# Altium project Testbench - Main.PrjPcb
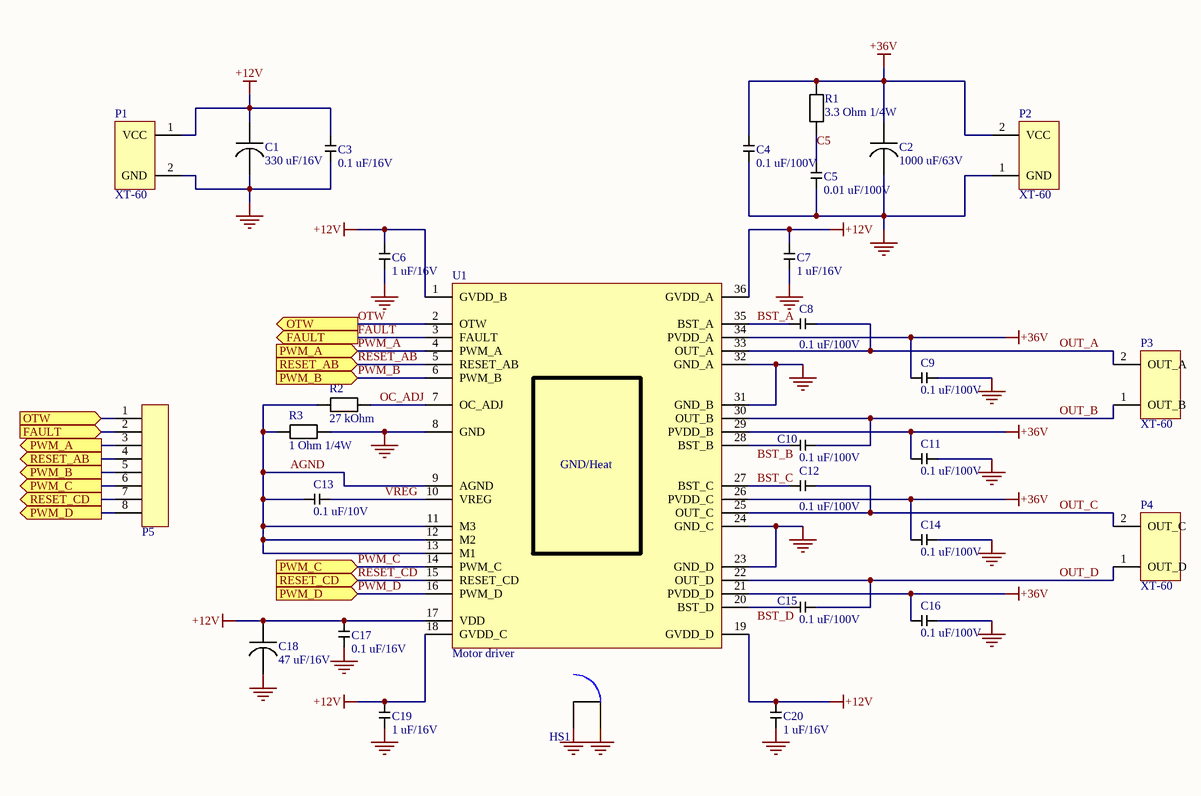
[diagram p0: TB Motor driver pcb.SchDoc]
1 sheet, 30 parts. Net scope: flat (ports and power ports of the same name join across sheets).
Board file: TB Motor driver pcb.PcbDoc

## Sheet TB Motor driver pcb.SchDoc
size A4

### Parts
C1  value 330 uF/16V  [C_EL_SMT_Ø10]  (hidden comment: C_EL_SMT_Ø10)
C2  value 1000 uF/63V  [C_EL_SMT_Ø18]  (hidden comment: C_EL_SMT_Ø18)
C3  value 0.1 uF/16V  [C_SMD_0805_pcb]  (hidden comment: SMD)
C4  value 0.1 uF/100V  [C_SMD_0805_pcb]  (hidden comment: SMD)
C5  value 0.01 uF/100V  [C_SMD_0805_pcb]  (hidden comment: SMD)
C6  value 1 uF/16V  [C_SMD_0805_pcb]  (hidden comment: SMD)
C7  value 1 uF/16V  [C_SMD_0805_pcb]  (hidden comment: SMD)
C8  value 0.1 uF/100V  [C_SMD_0805_pcb]  (hidden comment: SMD)
C9  value 0.1 uF/100V  [C_SMD_0805_pcb]  (hidden comment: SMD)
C10  value 0.1 uF/100V  [C_SMD_0805_pcb]  (hidden comment: SMD)
C11  value 0.1 uF/100V  [C_SMD_0805_pcb]  (hidden comment: SMD)
C12  value 0.1 uF/100V  [C_SMD_0805_pcb]  (hidden comment: SMD)
C13  value 0.1 uF/10V  [C_SMD_0805_pcb]  (hidden comment: SMD)
C14  value 0.1 uF/100V  [C_SMD_0805_pcb]  (hidden comment: SMD)
C15  value 0.1 uF/100V  [C_SMD_0805_pcb]  (hidden comment: SMD)
C16  value 0.1 uF/100V  [C_SMD_0805_pcb]  (hidden comment: SMD)
C17  value 0.1 uF/16V  [C_SMD_0805_pcb]  (hidden comment: SMD)
C18  value 47 uF/16V  [C_EL_SMT_Ø6.3]  (hidden comment: C_EL_SMT_Ø6.3)
C19  value 1 uF/16V  [C_SMD_0805_pcb]  (hidden comment: SMD)
C20  value 1 uF/16V  [C_SMD_0805_pcb]  (hidden comment: SMD)
HS1  ATS-1042-C1-R0  [HS_TB]  (value not drawn)
P1  XT-60  [XT-60]
P2  XT-60  [XT-60]
P3  XT-60  [XT-60]
P4  XT-60  [XT-60]
P5  JST_SE_8PIN  [JST_SE_8PIN]  (value not drawn)
R1  value 3.3 Ohm 1/4W  [R_SMD_0805_pcb]  (hidden comment: SMD)
R2  value 27 kOhm  [R_SMD_0805_pcb]  (hidden comment: SMD)
R3  value 1 Ohm 1/4W  [R_SMD_0805_pcb]  (hidden comment: SMD)
U1  Motor driver  [DRV8432DKDR-SOP36]

### Ports
FAULT (in), FAULT (out), OTW (in), OTW (out), PWM_A (in), PWM_A (out), PWM_B (in), PWM_B (out), PWM_C (in), PWM_C (out), PWM_D (in), PWM_D (out), RESET_AB (in), RESET_AB (out), RESET_CD (in), RESET_CD (out)

### Nets
+12V: C1.2 C3.1 C6.2 C7.2 C17.1 C18.2 C19.1 C20.1 P1.1(VCC) U1.1(GVDD_B) U1.17(VDD) U1.18(GVDD_C) U1.19(GVDD_D) U1.36(GVDD_A)
+36V: C2.2 C4.2 C9.2 C11.2 C14.2 C16.2 P2.2(VCC) R1.2 U1.21(PVDD_D) U1.26(PVDD_C) U1.29(PVDD_B) U1.34(PVDD_A)
GND: C1.1 C2.1 C3.2 C4.1 C5.2 C6.1 C7.1 C9.1 C11.1 C14.1 C16.1 C17.2 C18.1 C19.2 C20.2 HS1.1 HS1.2 P1.2(GND) P2.1(GND) R3.2 U1.8(GND) U1.23(GND_D) U1.24(GND_C) U1.31(GND_B) U1.32(GND_A)
AGND: C13.2 R2.1 R3.1 U1.9(AGND) U1.11(M3) U1.12(M2) U1.13(M1)
BST_A: C8.2 U1.35(BST_A)
BST_B: C10.2 U1.28(BST_B)
BST_C: C12.2 U1.27(BST_C)
BST_D: C15.2 U1.20(BST_D)
C5: C5.1 R1.1
FAULT: P5.2 U1.3(FAULT) ; port FAULT
OC_ADJ: R2.2 U1.7(OC_ADJ)
OTW: P5.1 U1.2(OTW) ; port OTW
OUT_A: C8.1 P3.2(OUT_A) U1.33(OUT_A)
OUT_B: C10.1 P3.1(OUT_B) U1.30(OUT_B)
OUT_C: C12.1 P4.2(OUT_C) U1.25(OUT_C)
OUT_D: C15.1 P4.1(OUT_D) U1.22(OUT_D)
PWM_A: P5.3 U1.4(PWM_A) ; port PWM_A
PWM_B: P5.5 U1.6(PWM_B) ; port PWM_B
PWM_C: P5.6 U1.14(PWM_C) ; port PWM_C
PWM_D: P5.8 U1.16(PWM_D) ; port PWM_D
RESET_AB: P5.4 U1.5(RESET_AB) ; port RESET_AB
RESET_CD: P5.7 U1.15(RESET_CD) ; port RESET_CD
VREG: C13.1 U1.10(VREG)

### Notes on the sheet
- (in symbol DRV8432DKDR) GND/Heat

### Library data of the parts
C3-C17 C19 C20 = C_SMD_0805: Supplier 1: *; Supplier Part Number 1: *
HS1 = ATS-1042-C1-R0: HEATSINK 41X45X15MM NYLONPUSHPIN; Manufacturer 1: Advanced Thermal Solutions; Package Cooled: BGA; Shape: Fins,Rectangular; Thermal Resistance @ Forced Air Flow (100 LFM): 2.5°C/W; Supplier 1: Digi-Key; Supplier Part Number 1: ATS1410-ND; Manufacturer Part Number 1: ATS-1042-C1-R0; Stock 1: 342; Pricing 1: 1=14,16000, 10=13,36900, 25=12,58280, 50=11,79640, 100=11,00990, 250=10,22348, 500=10,02686, 1000=9,83025 (USD); RoHS: Yes; Mount: Push Pin; Color: Green; Material: Aluminium; Package Quantity: 100; Type: Passive; Packaging: Bulk; Length: 41mm; Height: 15mm; Width: 1.772inch; Height Off Base: 0.59inch; Depth: 45mm; Radiation Hardening: No; ComponentLink1URL: https://datasheet.ciiva.com/1004/ats1042c1r0ds-1004563.pdf?src-supplier=Digi-Key; ComponentLink1Description: https://datasheet.ciiva.com/1004/ats1042c1r0ds-1004563.pdf?src-supplier=Digi-Key; ComponentLink2URL: https://datasheet.ciiva.com/26934/getdatasheetpartid-779707-26934888.pdf?src-supplier=Verical; ComponentLink2Description: https://datasheet.ciiva.com/26934/getdatasheetpartid-779707-26934888.pdf?src-supplier=Verical; ComponentLink3URL: https://datasheet.ciiva.com/16381/ats-1042-c1-r0-16381194.pdf?src-supplier=Mouser; ComponentLink3Description: https://datasheet.ciiva.com/16381/ats-1042-c1-r0-16381194.pdf?src-supplier=Mouser
R1-R3 = R_SMD_0805: Supplier 1: *; Supplier Part Number 1: *
U1 = DRV8432DKDR: IC BRIDGE DRIVER PAR 36HSSOP; Manufacturer 1: Texas Instruments; Max Supply Voltage: 52.5V; Min Supply Voltage: 0uV; Operating Supply Voltage: 50V; Number of Outputs: 2; Output Current: 7A; Nominal Supply Current: 10.5mA; Interface: PWM; Power Dissipation: 5W; Max Output Current: 12A; Fault Protection: Over Temperature,Short Circuit; Supplier 1: Digi-Key; Supplier Part Number 1: 296-29573-1-ND; Manufacturer Part Number 1: DRV8432DKDR; Stock 1: 2413; Pricing 1: 1=11,86000, 10=10,71800, 25=10,21960, 100=8,47480, 250=7,72708 (USD); RoHS: Yes; Mount: Surface Mount; Number of Pins: 36; Min Operating Temperature: -40°C; Max Operating Temperature: 85°C; Packaging: Tape and Reel; Package Quantity: 500; Output Current per Channel: 7A; Radiation Hardening: No; Lead Free: Lead Free; ComponentLink1URL: https://datasheet.ciiva.com/15109/getdatasheetpartid-482142-15109561.pdf?src-supplier=Verical; ComponentLink1Description: https://datasheet.ciiva.com/15109/getdatasheetpartid-482142-15109561.pdf?src-supplier=Verical; ComponentLink2URL: https://datasheet.ciiva.com/1959/drv8432-1959978.pdf?src-supplier=Digi-Key; ComponentLink2Description: https://datasheet.ciiva.com/1959/drv8432-1959978.pdf?src-supplier=Digi-Key; ComponentLink3URL: https://datasheet.ciiva.com/41457/001013555-da-01-en-ic-bridge-driver-drv8432dkdr-ssop-36-tid-41457289.pdf?src-supplier=Conrad; ComponentLink3Description: https://datasheet.ciiva.com/41457/001013555-da-01-en-ic-bridge-driver-drv8432dkdr-ssop-36-tid-41457289.pdf?src-supplier=Conrad; ComponentLink4URL: https://datasheet.ciiva.com/3228/drv8432-3228999.pdf?src-supplier=Avnet; ComponentLink4Description: https://datasheet.ciiva.com/3228/drv8432-3228999.pdf?src-supplier=Avnet; ComponentLink5URL: https://datasheet.ciiva.com/1959/drv8432-1959979.pdf?src-supplier=Digi-Key; ComponentLink5Description: https://datasheet.ciiva.com/1959/drv8432-1959979.pdf?src-supplier=Digi-Key; ComponentLink6URL: https://datasheet.ciiva.com/1959/drv8432-1959980.pdf?src-supplier=Digi-Key; ComponentLink6Description: https://datasheet.ciiva.com/1959/drv8432-1959980.pdf?src-supplier=Digi-Key; Category: Integrated Circuits (ICs)
C1 = C_EL_SMT_Ø10: Supplier 1: *; Supplier Part Number 1: *
C2 = C_EL_SMT_Ø18: Supplier 1: *; Supplier Part Number 1: *; Category: Capacitors
C18 = C_EL_SMT_Ø6.3: Supplier 1: *; Supplier Part Number 1: *
P1-P4 = XT-60: Supplier Part Number 1: *; Supplier 1: *
P5 = JST_SE_8PIN: Supplier 1: *; Supplier Part Number 1: *; Category: Pin Header